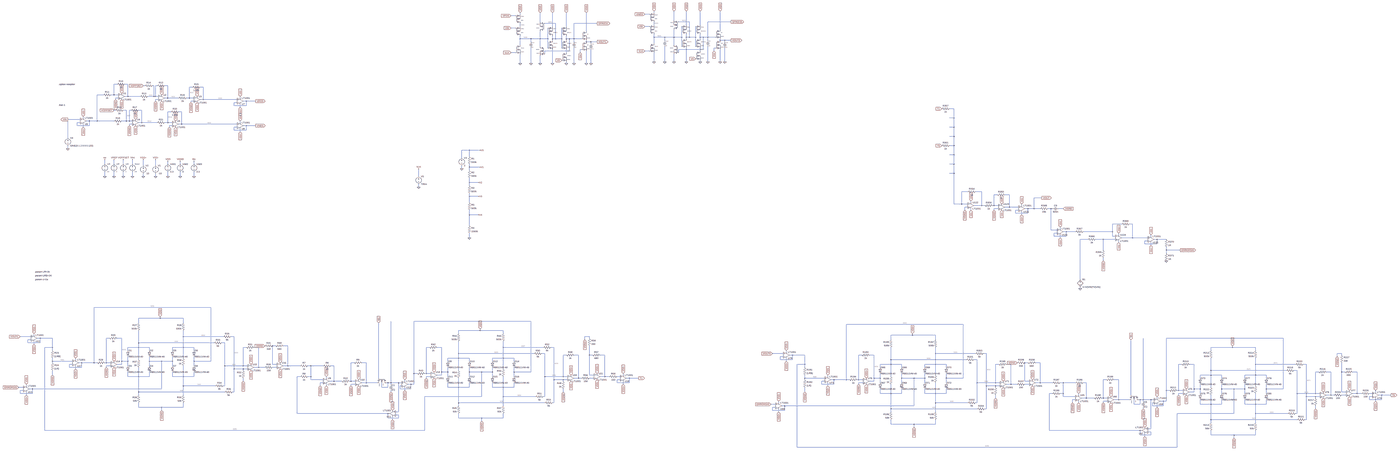
[diagram p0: schematic OZ_2_pure_curves.asc, whole sheet]
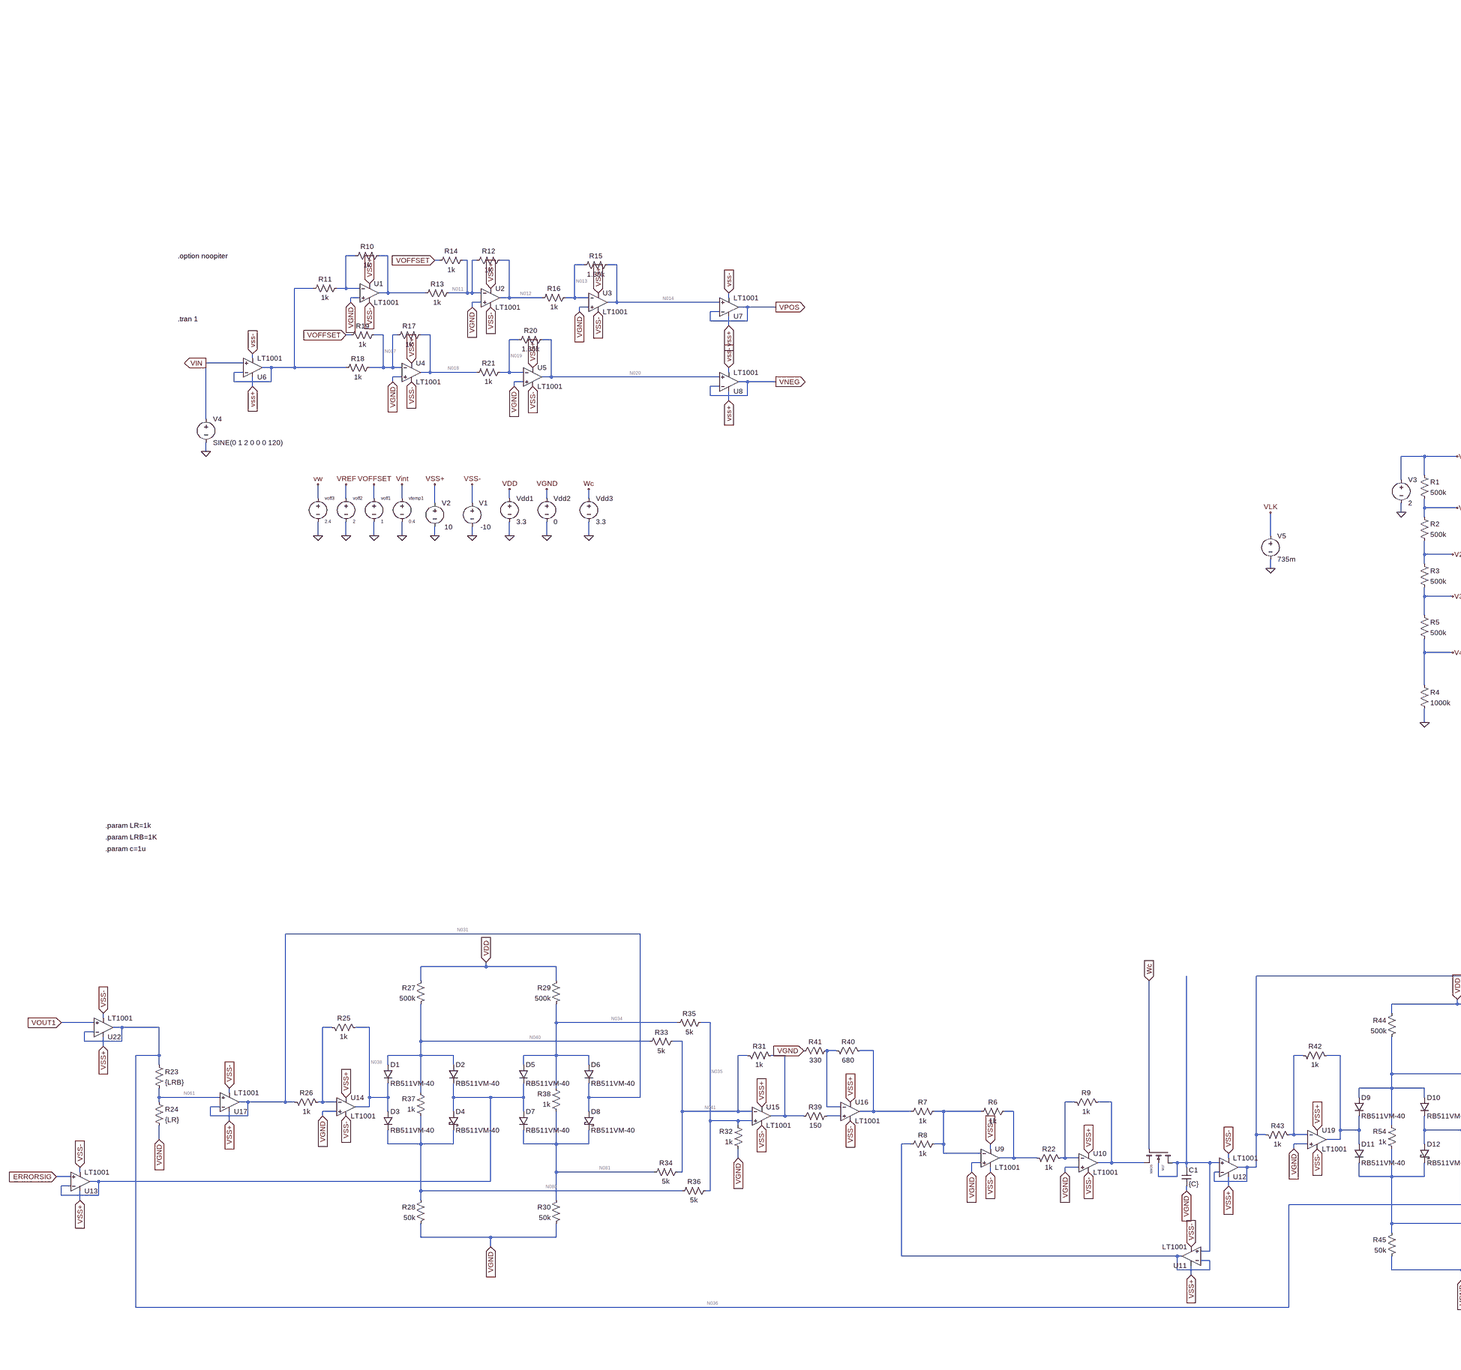
[diagram p1: schematic OZ_2_pure_curves.asc, part, row 1 of 1, column 1 of 3]
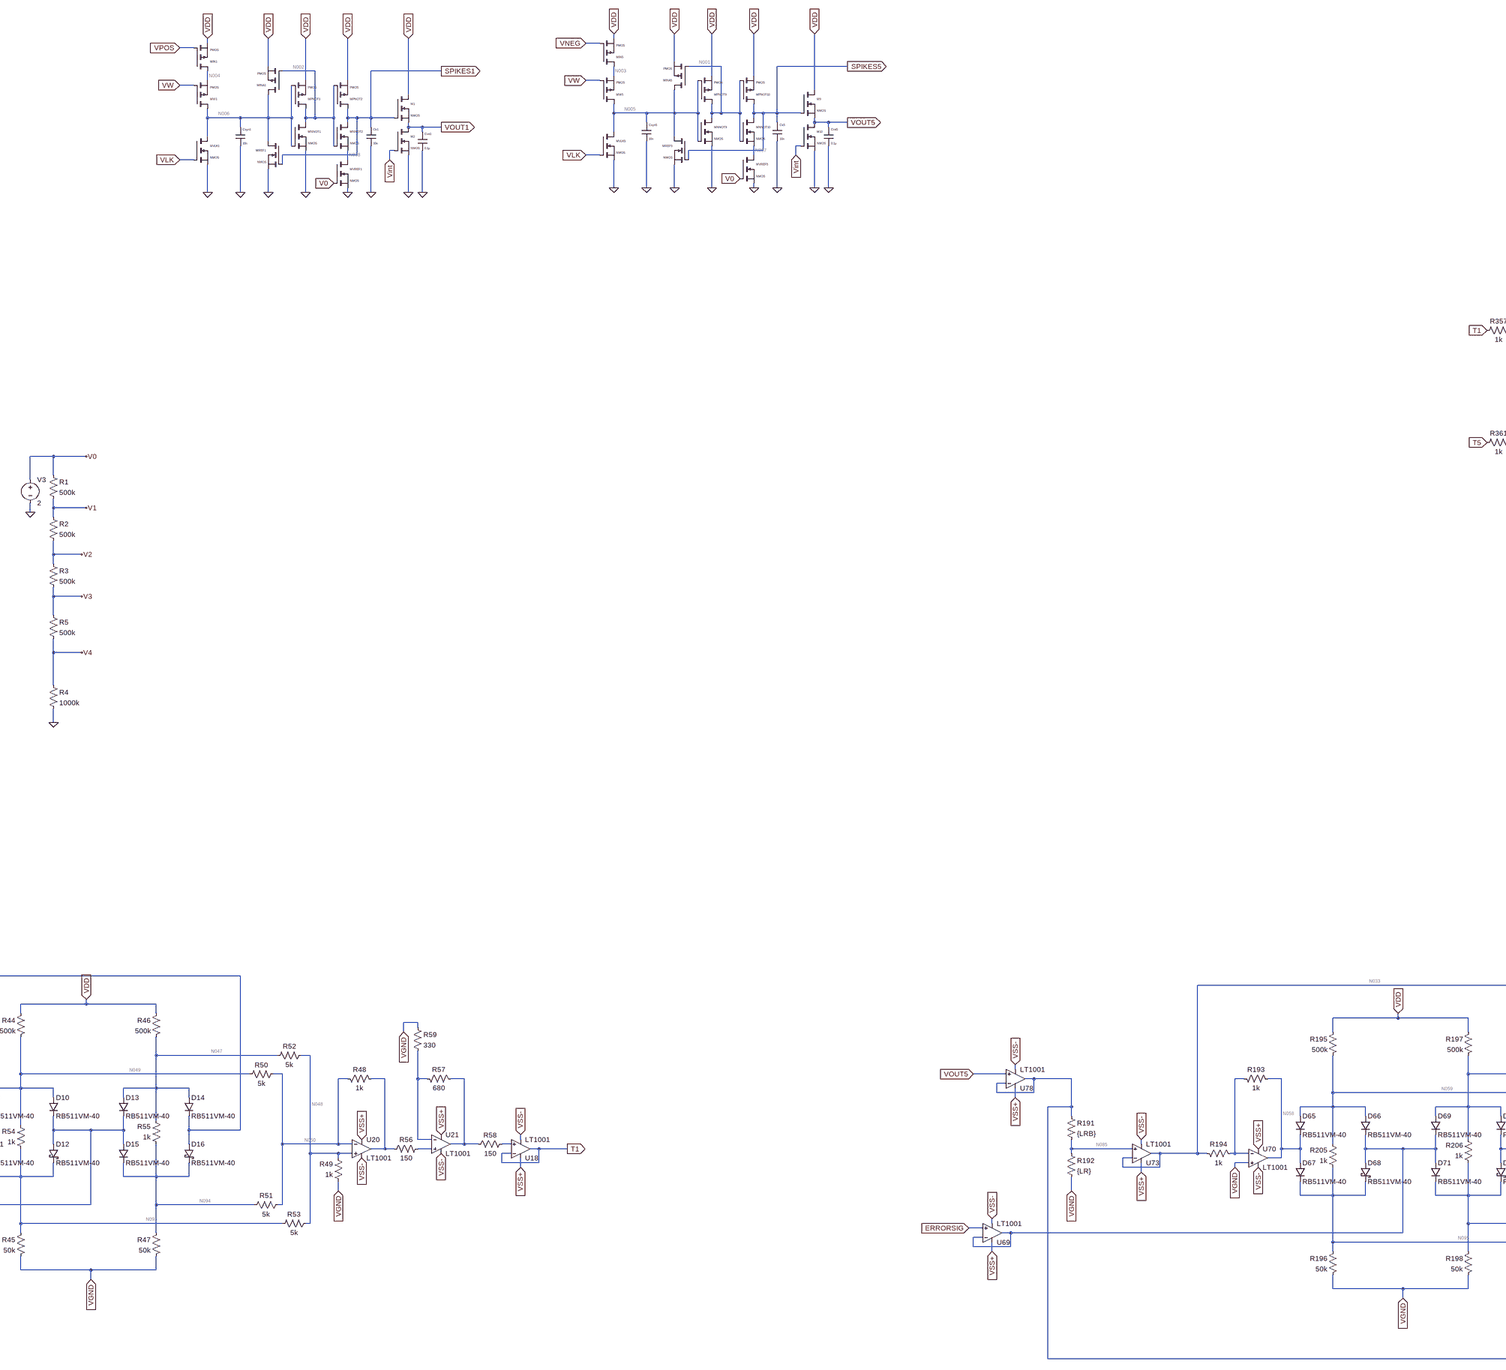
[diagram p2: schematic OZ_2_pure_curves.asc, part, row 1 of 1, column 2 of 3]
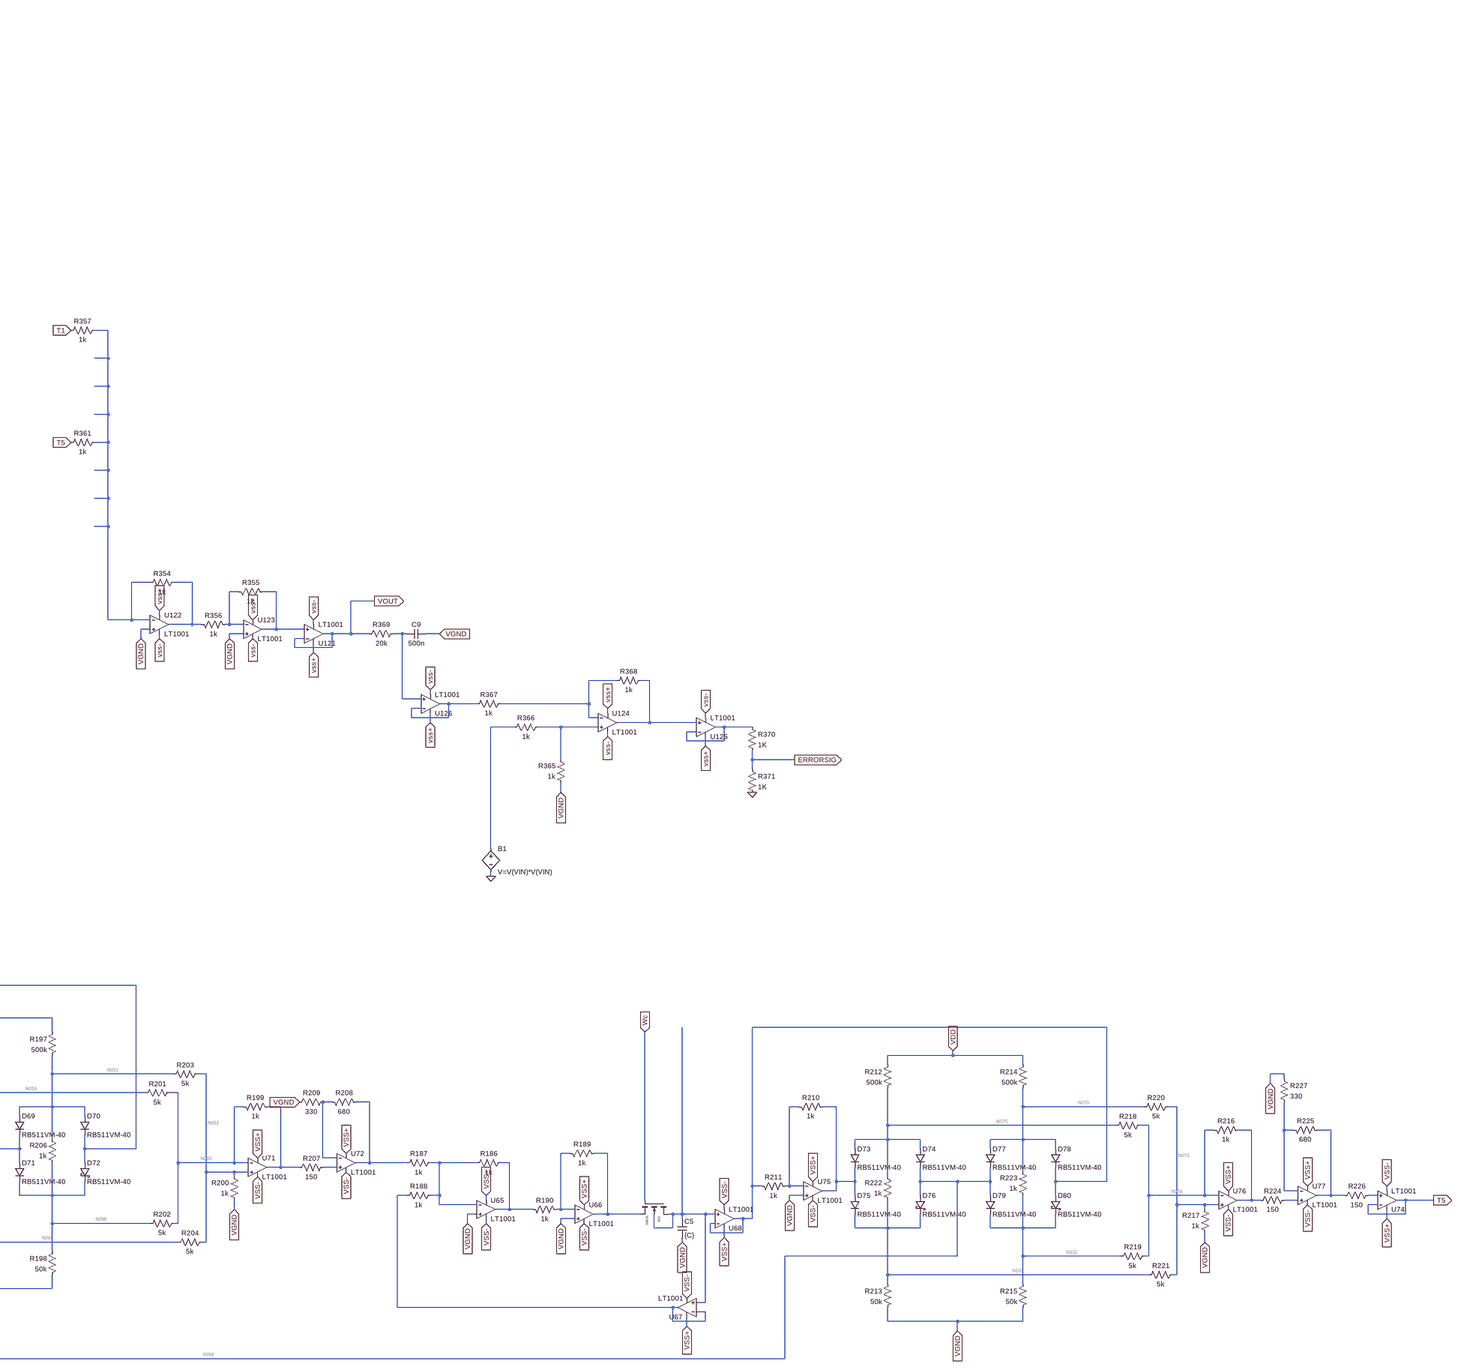
[diagram p3: schematic OZ_2_pure_curves.asc, part, row 1 of 1, column 3 of 3]
* OZ_2_pure_curves.asc
vtemp1 Vint 0 0.4
Vdd1 VDD 0 3.3
V1 VSS- 0 -10
V2 VSS+ 0 10
voff1 VOFFSET 0 1
voff2 VREF 0 2
voff3 vw 0 2.4
Vdd2 VGND 0 0
XU1 VGND N009 VSS+ VSS- N010 LT1001  ; pins In+ In- V+ V- OUT
R10 N010 N009 1k
R11 N009 N015 1k
XU2 VGND N011 VSS+ VSS- N012 LT1001  ; pins In+ In- V+ V- OUT
R12 N012 N011 1k
R13 N011 N010 1k
R14 N011 VOFFSET 1k
XU3 VGND N013 VSS+ VSS- N014 LT1001  ; pins In+ In- V+ V- OUT
R15 N014 N013 1.65k
R16 N013 N012 1k
XU4 VGND N017 VSS+ VSS- N018 LT1001  ; pins In+ In- V+ V- OUT
R17 N018 N017 1k
R18 N017 N015 1k
R19 N017 VOFFSET 1k
XU5 VGND N019 VSS+ VSS- N020 LT1001  ; pins In+ In- V+ V- OUT
R20 N020 N019 1.65k
R21 N019 N018 1k
XU6 VIN N015 VSS+ VSS- N015 LT1001  ; pins In+ In- V+ V- OUT
XU7 N014 VPOS VSS+ VSS- VPOS LT1001  ; pins In+ In- V+ V- OUT
XU8 N020 VNEG VSS+ VSS- VNEG LT1001  ; pins In+ In- V+ V- OUT
V4 VIN 0 SINE(0 1 2 0 0 0 120)
XU121 N023 VOUT VSS+ VSS- VOUT LT1001  ; pins In+ In- V+ V- OUT
XU122 VGND N016 VSS+ VSS- N021 LT1001  ; pins In+ In- V+ V- OUT
R354 N021 N016 1k
XU123 VGND N022 VSS+ VSS- N023 LT1001  ; pins In+ In- V+ V- OUT
R355 N022 N023 1k
R356 N021 N022 1k
R357 N016 T1 1k
R361 N016 T5 1k
M17 N089 Wc N064 N089 NMOS
C1 N089 VGND {C} IC=0
XU9 VGND N072 VSS+ VSS- N073 LT1001  ; pins In+ In- V+ V- OUT
R6 N073 N072 1k
R7 N072 N043 1k
R8 N072 N082 1k
XU10 VGND N063 VSS+ VSS- N064 LT1001  ; pins In+ In- V+ V- OUT
R9 N063 N064 1k
R22 N073 N063 1k
XU11 N089 N082 VSS+ VSS- N082 LT1001  ; pins In+ In- V+ V- OUT
XU12 N089 N032 VSS+ VSS- N032 LT1001  ; pins In+ In- V+ V- OUT
R23 N036 N061 {LRB}
R24 N061 VGND {LR}
XU13 ERRORSIG N062 VSS+ VSS- N062 LT1001  ; pins In+ In- V+ V- OUT
D1 N040 N038 RB511VM-40
XU14 VGND N037 VSS+ VSS- N038 LT1001  ; pins In+ In- V+ V- OUT
R25 N037 N038 1k
R26 N031 N037 1k
D2 N040 N062 RB511VM-40
D3 N038 N080 RB511VM-40
D4 N062 N080 RB511VM-40
R27 VDD N040 500k
R28 N080 VGND 50k
D5 N034 N062 RB511VM-40
D6 N034 N031 RB511VM-40
D7 N062 N081 RB511VM-40
D8 N031 N081 RB511VM-40
R29 VDD N034 500k
R30 N081 VGND 50k
XU15 N035 N041 VSS+ VSS- N044 LT1001  ; pins In+ In- V+ V- OUT
R31 N041 N044 1k
R32 VGND N035 1k
R33 N041 N040 5k
R34 N041 N081 5k
R35 N035 N034 5k
R36 N035 N080 5k
R37 N080 N040 1k
R38 N081 N034 1k
R39 N044 N074 150
XU16 N074 N042 VSS+ VSS- N043 LT1001  ; pins In+ In- V+ V- OUT
R40 N042 N043 680
R41 VGND N042 330
XU17 N061 N031 VSS+ VSS- N031 LT1001  ; pins In+ In- V+ V- OUT
XU18 N083 T1 VSS+ VSS- T1 LT1001  ; pins In+ In- V+ V- OUT
D9 N049 N046 RB511VM-40
XU19 VGND N045 VSS+ VSS- N046 LT1001  ; pins In+ In- V+ V- OUT
R42 N045 N046 1k
R43 N032 N045 1k
D10 N049 N036 RB511VM-40
D11 N046 N093 RB511VM-40
D12 N036 N093 RB511VM-40
R44 VDD N049 500k
R45 N093 VGND 50k
D13 N047 N036 RB511VM-40
D14 N047 N032 RB511VM-40
D15 N036 N094 RB511VM-40
D16 N032 N094 RB511VM-40
R46 VDD N047 500k
R47 N094 VGND 50k
XU20 N048 N050 VSS+ VSS- N053 LT1001  ; pins In+ In- V+ V- OUT
R48 N050 N053 1k
R49 VGND N048 1k
R50 N050 N049 5k
R51 N050 N094 5k
R52 N048 N047 5k
R53 N048 N093 5k
R54 N093 N049 1k
R55 N094 N047 1k
R56 N053 N084 150
XU21 N084 N054 VSS+ VSS- N055 LT1001  ; pins In+ In- V+ V- OUT
R57 N054 N055 680
R58 N055 N083 150
R59 VGND N054 330
XU22 VOUT1 N036 VSS+ VSS- N036 LT1001  ; pins In+ In- V+ V- OUT
M21 N100 Wc N088 N100 NMOS
C5 N100 VGND {C} IC=0
XU65 VGND N090 VSS+ VSS- N091 LT1001  ; pins In+ In- V+ V- OUT
R186 N091 N090 1k
R187 N090 N066 1k
R188 N090 N097 1k
XU66 VGND N087 VSS+ VSS- N088 LT1001  ; pins In+ In- V+ V- OUT
R189 N087 N088 1k
R190 N091 N087 1k
XU67 N100 N097 VSS+ VSS- N097 LT1001  ; pins In+ In- V+ V- OUT
XU68 N100 N039 VSS+ VSS- N039 LT1001  ; pins In+ In- V+ V- OUT
R191 N056 N085 {LRB}
R192 N085 VGND {LR}
XU69 ERRORSIG N086 VSS+ VSS- N086 LT1001  ; pins In+ In- V+ V- OUT
D65 N059 N058 RB511VM-40
XU70 VGND N057 VSS+ VSS- N058 LT1001  ; pins In+ In- V+ V- OUT
R193 N057 N058 1k
R194 N033 N057 1k
D66 N059 N086 RB511VM-40
D67 N058 N095 RB511VM-40
D68 N086 N095 RB511VM-40
R195 VDD N059 500k
R196 N095 VGND 50k
D69 N051 N086 RB511VM-40
D70 N051 N033 RB511VM-40
D71 N086 N096 RB511VM-40
D72 N033 N096 RB511VM-40
R197 VDD N051 500k
R198 N096 VGND 50k
XU71 N052 N060 VSS+ VSS- N067 LT1001  ; pins In+ In- V+ V- OUT
R199 N060 N067 1k
R200 VGND N052 1k
R201 N060 N059 5k
R202 N060 N096 5k
R203 N052 N051 5k
R204 N052 N095 5k
R205 N095 N059 1k
R206 N096 N051 1k
R207 N067 N092 150
XU72 N092 N065 VSS+ VSS- N066 LT1001  ; pins In+ In- V+ V- OUT
R208 N065 N066 680
R209 VGND N065 330
XU73 N085 N033 VSS+ VSS- N033 LT1001  ; pins In+ In- V+ V- OUT
XU74 N098 T5 VSS+ VSS- T5 LT1001  ; pins In+ In- V+ V- OUT
D73 N075 N069 RB511VM-40
XU75 VGND N068 VSS+ VSS- N069 LT1001  ; pins In+ In- V+ V- OUT
R210 N068 N069 1k
R211 N039 N068 1k
D74 N075 N056 RB511VM-40
D75 N069 N101 RB511VM-40
D76 N056 N101 RB511VM-40
R212 VDD N075 500k
R213 N101 VGND 50k
D77 N070 N056 RB511VM-40
D78 N070 N039 RB511VM-40
D79 N056 N102 RB511VM-40
D80 N039 N102 RB511VM-40
R214 VDD N070 500k
R215 N102 VGND 50k
XU76 N071 N076 VSS+ VSS- N077 LT1001  ; pins In+ In- V+ V- OUT
R216 N076 N077 1k
R217 VGND N071 1k
R218 N076 N075 5k
R219 N076 N102 5k
R220 N071 N070 5k
R221 N071 N101 5k
R222 N101 N075 1k
R223 N102 N070 1k
R224 N077 N099 150
XU77 N099 N078 VSS+ VSS- N079 LT1001  ; pins In+ In- V+ V- OUT
R225 N078 N079 680
R226 N079 N098 150
R227 VGND N078 330
XU78 VOUT5 N056 VSS+ VSS- N056 LT1001  ; pins In+ In- V+ V- OUT
XU124 N029 N025 VSS+ VSS- N026 LT1001  ; pins In+ In- V+ V- OUT
R365 VGND N029 1k
R366 N029 N028 1k
R367 N025 N027 1k
R368 N026 N025 1k
XU125 N026 N030 VSS+ VSS- N030 LT1001  ; pins In+ In- V+ V- OUT
R369 VOUT N024 20k
C9 N024 VGND 500n
XU126 N024 N027 VSS+ VSS- N027 LT1001  ; pins In+ In- V+ V- OUT
R370 N030 ERRORSIG 1K
R371 ERRORSIG 0 1K
Vdd3 Wc 0 3.3
MW1 N006 vw N004 N004 PMOS
Csyn1 N006 0 10n V=4 Irms=162m Rser=0.395426 Lser=0 mfg="KEMET" pn="C0402C103K7PAC" type="X5R" IC=0
Ck1 SPIKES1 0 10n
MPNOT1 N002 N006 VDD VDD PMOS
MNNOT1 N002 N006 0 0 NMOS
MVREF1 N008 V0 0 0 NMOS
MREF1 N006 SPIKES1 0 0 NMOS
MVLK1 N006 VLK 0 0 NMOS
MINA1 N006 N002 VDD VDD PMOS
MIN1 N004 VPOS VDD VDD PMOS
MPNOT2 SPIKES1 N002 VDD VDD PMOS
MNNOT2 SPIKES1 N002 N008 N008 NMOS
M1 VDD SPIKES1 VOUT1 VOUT1 NMOS
M2 VOUT1 Vint 0 0 NMOS
Cint1 VOUT1 0 0.1µ
MW5 N005 vw N003 N003 PMOS
Csyn5 N005 0 10n V=4 Irms=162m Rser=0.395426 Lser=0 mfg="KEMET" pn="C0402C103K7PAC" type="X5R" IC=0
Ck5 SPIKES5 0 10n
MPNOT9 N001 N005 VDD VDD PMOS
MNNOT9 N001 N005 0 0 NMOS
MVREF5 N007 V0 0 0 NMOS
MREF5 N005 SPIKES5 0 0 NMOS
MVLK5 N005 VLK 0 0 NMOS
MINA5 N005 N001 VDD VDD PMOS
MIN5 N003 VNEG VDD VDD PMOS
MPNOT10 SPIKES5 N001 VDD VDD PMOS
MNNOT10 SPIKES5 N001 N007 N007 NMOS
M9 VDD SPIKES5 VOUT5 VOUT5 NMOS
M10 VOUT5 Vint 0 0 NMOS
Cint5 VOUT5 0 0.1µ
V3 V0 0 2
R1 V0 V1 500k
R2 V1 V2 500k
R3 V2 V3 500k
R4 V4 0 1000k
R5 V3 V4 500k
V5 VLK 0 735m
B1 N028 0 V=V(VIN)*V(VIN)
.model D D
.lib standard.dio
.model NMOS NMOS
.model PMOS PMOS
.lib standard.mos
.tran 1
.option noopiter
.param LR=1k
.param LRB=1K
.param c=1u
.lib LTC.lib
.backanno
.end

* Results of the author's LTspice run, read from the files saved beside the schematic
* Operating Point, zero values left out:
*   V(vint) = 400 mV
*   V(vdd) = 3.3 V
*   V(vss-) = -10 V
*   V(vss+) = 10 V
*   V(voffset) = 1 V
*   V(vref) = 2 V
*   V(vw) = 2.4 V
*   V(n011) = 1.43 µV
*   V(n012) = -1 V
*   V(n013) = -2.256 µV
*   V(n014) = 1.65 V
*   V(n017) = 1.43 µV
*   V(n018) = -1 V
*   V(n019) = -2.256 µV
*   V(n020) = 1.65 V
*   V(vpos) = 1.65 V
*   V(vneg) = 1.65 V
*   V(wc) = 3.3 V
*   V(n036) = 826.3 nV
*   V(n061) = 413.2 nV
*   V(n040) = 19.24 mV
*   V(n038) = -413.1 nV
*   V(n031) = 413.2 nV
*   V(n080) = 16.29 mV
*   V(n034) = 19.24 mV
*   V(n081) = 16.29 mV
*   V(n041) = 5.076 mV
*   V(n035) = 5.076 mV
*   V(n049) = 19.24 mV
*   V(n093) = 16.29 mV
*   V(n047) = 19.24 mV
*   V(n094) = 16.29 mV
*   V(n050) = 5.076 mV
*   V(n048) = 5.076 mV
*   V(vout1) = 826.3 nV
*   V(n056) = 826.3 nV
*   V(n085) = 413.2 nV
*   V(n059) = 19.24 mV
*   V(n058) = -413.1 nV
*   V(n033) = 413.2 nV
*   V(n095) = 16.29 mV
*   V(n051) = 19.24 mV
*   V(n096) = 16.29 mV
*   V(n060) = 5.076 mV
*   V(n052) = 5.076 mV
*   V(n075) = 19.24 mV
*   V(n101) = 16.29 mV
*   V(n070) = 19.24 mV
*   V(n102) = 16.29 mV
*   V(n076) = 5.076 mV
*   V(n071) = 5.076 mV
*   V(vout5) = 826.3 nV
*   V(n006) = 2.106 µV
*   V(n004) = 3.13 V
*   V(spikes1) = 265.4 nV
*   V(n002) = 3.3 V
*   V(n008) = 165.2 nV
*   V(v0) = 2 V
*   V(vlk) = 735 mV
*   V(n005) = 2.106 µV
*   V(n003) = 3.13 V
*   V(spikes5) = 265.4 nV
*   V(n001) = 3.3 V
*   V(n007) = 165.2 nV
*   V(v1) = 1.667 V
*   V(v2) = 1.333 V
*   V(v3) = 1 V
*   V(v4) = 666.7 mV
*   Id(Mpnot10) = -6.61 pA
*   Ib(Mpnot10) = 3.31 pA
*   Is(Mpnot10) = 3.3 pA
*   Id(Min5) = -5.326 µA
*   Is(Min5) = 5.326 µA
*   Id(Mina5) = -6.61 pA
*   Ib(Mina5) = 3.31 pA
*   Is(Mina5) = 3.3 pA
*   Id(Mpnot9) = -6.61 pA
*   Is(Mpnot9) = 6.61 pA
*   Id(Mw5) = -5.326 µA
*   Ib(Mw5) = 3.14 pA
*   Is(Mw5) = 5.326 µA
*   Id(Mpnot2) = -6.61 pA
*   Ib(Mpnot2) = 3.31 pA
*   Is(Mpnot2) = 3.3 pA
*   Id(Min1) = -5.326 µA
*   Is(Min1) = 5.326 µA
*   Id(Mina1) = -6.61 pA
*   Ib(Mina1) = 3.31 pA
*   Is(Mina1) = 3.3 pA
*   Id(Mpnot1) = -6.61 pA
*   Is(Mpnot1) = 6.61 pA
*   Id(Mw1) = -5.326 µA
*   Ib(Mw1) = 3.14 pA
*   Is(Mw1) = 5.326 µA
*   Id(M10) = 6.61 pA
*   Is(M10) = -6.61 pA
*   Id(M9) = 6.61 pA
*   Ib(M9) = -3.31 pA
*   Is(M9) = -3.3 pA
*   Id(Mnnot10) = 6.61 pA
*   Is(Mnnot10) = -6.61 pA
*   Id(Mvlk5) = 30.96 pA
*   Is(Mvlk5) = -30.96 pA
*   Id(Mvref5) = 6.61 pA
*   Is(Mvref5) = -6.61 pA
*   Id(Mnnot9) = 6.61 pA
*   Ib(Mnnot9) = -3.31 pA
*   Is(Mnnot9) = -3.3 pA
*   Id(M2) = 6.61 pA
*   Is(M2) = -6.61 pA
*   Id(M1) = 6.61 pA
*   Ib(M1) = -3.31 pA
*   Is(M1) = -3.3 pA
*   Id(Mnnot2) = 6.61 pA
*   Is(Mnnot2) = -6.61 pA
*   Id(Mvlk1) = 30.96 pA
*   Is(Mvlk1) = -30.96 pA
*   Id(Mvref1) = 6.61 pA
*   Is(Mvref1) = -6.61 pA
*   Id(Mnnot1) = 6.61 pA
*   Ib(Mnnot1) = -3.31 pA
*   Is(Mnnot1) = -3.3 pA
*   I(Csyn5) = 5.326 µA
*   I(Csyn1) = 5.326 µA
*   I(D80) = -190.8 nA
*   I(D79) = -190.8 nA
*   I(D78) = 389 nA
*   I(D77) = 389 nA
*   I(D76) = -190.8 nA
*   I(D75) = -190.8 nA
*   I(D74) = 389 nA
*   I(D73) = 389 nA
*   I(D72) = -190.8 nA
*   I(D71) = -190.8 nA
*   I(D70) = 389 nA
*   I(D69) = 389 nA
*   I(D68) = -190.8 nA
*   I(D67) = -190.8 nA
*   I(D66) = 389 nA
*   I(D65) = 389 nA
*   I(D16) = -190.8 nA
*   I(D15) = -190.8 nA
*   I(D14) = 389 nA
*   I(D13) = 389 nA
*   I(D12) = -190.8 nA
*   I(D11) = -190.8 nA
*   I(D10) = 389 nA
*   I(D9) = 389 nA
*   I(D8) = -190.8 nA
*   I(D7) = -190.8 nA
*   I(D6) = 389 nA
*   I(D5) = 389 nA
*   I(D4) = -190.8 nA
*   I(D3) = -190.8 nA
*   I(D2) = 389 nA
*   I(D1) = 389 nA
*   I(R5) = 666.7 nA
*   I(R4) = 666.7 nA
*   I(R3) = 666.7 nA
*   I(R2) = 666.7 nA
*   I(R1) = 666.7 nA
*   I(R368) = -1.903 pA
*   I(R367) = -1.903 pA
*   I(R223) = -2.95 µA
*   I(R222) = -2.95 µA
*   I(R221) = -2.243 µA
*   I(R220) = -2.833 µA
*   I(R219) = -2.243 µA
*   I(R218) = -2.833 µA
*   I(R217) = -5.076 µA
*   I(R216) = 5.076 µA
*   I(R215) = 325.8 nA
*   I(R214) = 6.562 µA
*   I(R213) = 325.8 nA
*   I(R212) = 6.562 µA
*   I(R209) = -4.61 pA
*   I(R208) = -4.61 pA
*   I(R206) = -2.95 µA
*   I(R205) = -2.95 µA
*   I(R204) = -2.243 µA
*   I(R203) = -2.833 µA
*   I(R202) = -2.243 µA
*   I(R201) = -2.833 µA
*   I(R200) = -5.076 µA
*   I(R199) = 5.076 µA
*   I(R198) = 325.8 nA
*   I(R197) = 6.562 µA
*   I(R196) = 325.8 nA
*   I(R195) = 6.562 µA
*   I(R194) = 413.1 pA
*   I(R193) = 413.1 pA
*   I(R192) = 413.2 pA
*   I(R191) = 413.2 pA
*   I(R190) = -4.656 pA
*   I(R189) = -4.656 pA
*   I(R187) = -4.656 pA
*   I(R186) = -4.656 pA
*   I(R55) = -2.95 µA
*   I(R54) = -2.95 µA
*   I(R53) = -2.243 µA
*   I(R52) = -2.833 µA
*   I(R51) = -2.243 µA
*   I(R50) = -2.833 µA
*   I(R49) = -5.076 µA
*   I(R48) = 5.076 µA
*   I(R47) = 325.8 nA
*   I(R46) = 6.562 µA
*   I(R45) = 325.8 nA
*   I(R44) = 6.562 µA
*   I(R41) = -4.61 pA
*   I(R40) = -4.61 pA
*   I(R38) = -2.95 µA
*   I(R37) = -2.95 µA
*   I(R36) = -2.243 µA
*   I(R35) = -2.833 µA
*   I(R34) = -2.243 µA
*   I(R33) = -2.833 µA
*   I(R32) = -5.076 µA
*   I(R31) = 5.076 µA
*   I(R30) = 325.8 nA
*   I(R29) = 6.562 µA
*   I(R28) = 325.8 nA
*   I(R27) = 6.562 µA
*   I(R26) = 413.1 pA
*   I(R25) = 413.1 pA
*   I(R24) = 413.2 pA
*   I(R23) = 413.2 pA
*   I(R22) = -4.656 pA
*   I(R9) = -4.656 pA
*   I(R7) = -4.656 pA
*   I(R6) = -4.656 pA
*   I(R356) = -1.903 pA
*   I(R355) = -1.903 pA
*   I(R354) = -1.903 pA
*   I(R21) = 1 mA
*   I(R20) = 1 mA
*   I(R19) = -1 mA
*   I(R18) = 1.43 nA
*   I(R17) = -1 mA
*   I(R16) = 1 mA
*   I(R15) = 1 mA
*   I(R14) = -1 mA
*   I(R13) = 1.43 nA
*   I(R12) = -1 mA
*   I(V3) = -666.7 nA
*   I(Vdd2) = 22.91 µA
*   I(Voff1) = -2 mA
*   I(V2) = -93.76 mA
*   I(V1) = 95.79 mA
*   I(Vdd1) = -63.14 µA